# EAGLE design CANBed_FD (EAGLE 6.4)
DESCRIPTION: microOBD 200 OBD-II Module; HW_REV: 1.4; PCB_REV: C; PCB_SPEC1: Layer Count: 4; PCB_SPEC2: Size: 1.3" x 0.59"; PCB_SPEC3: Finish Thickness: 0.049" - 0.052"; PCB_SPEC4: Copper Weight: 1oz; TITLE: STM1120

## Sheet 1 of 2
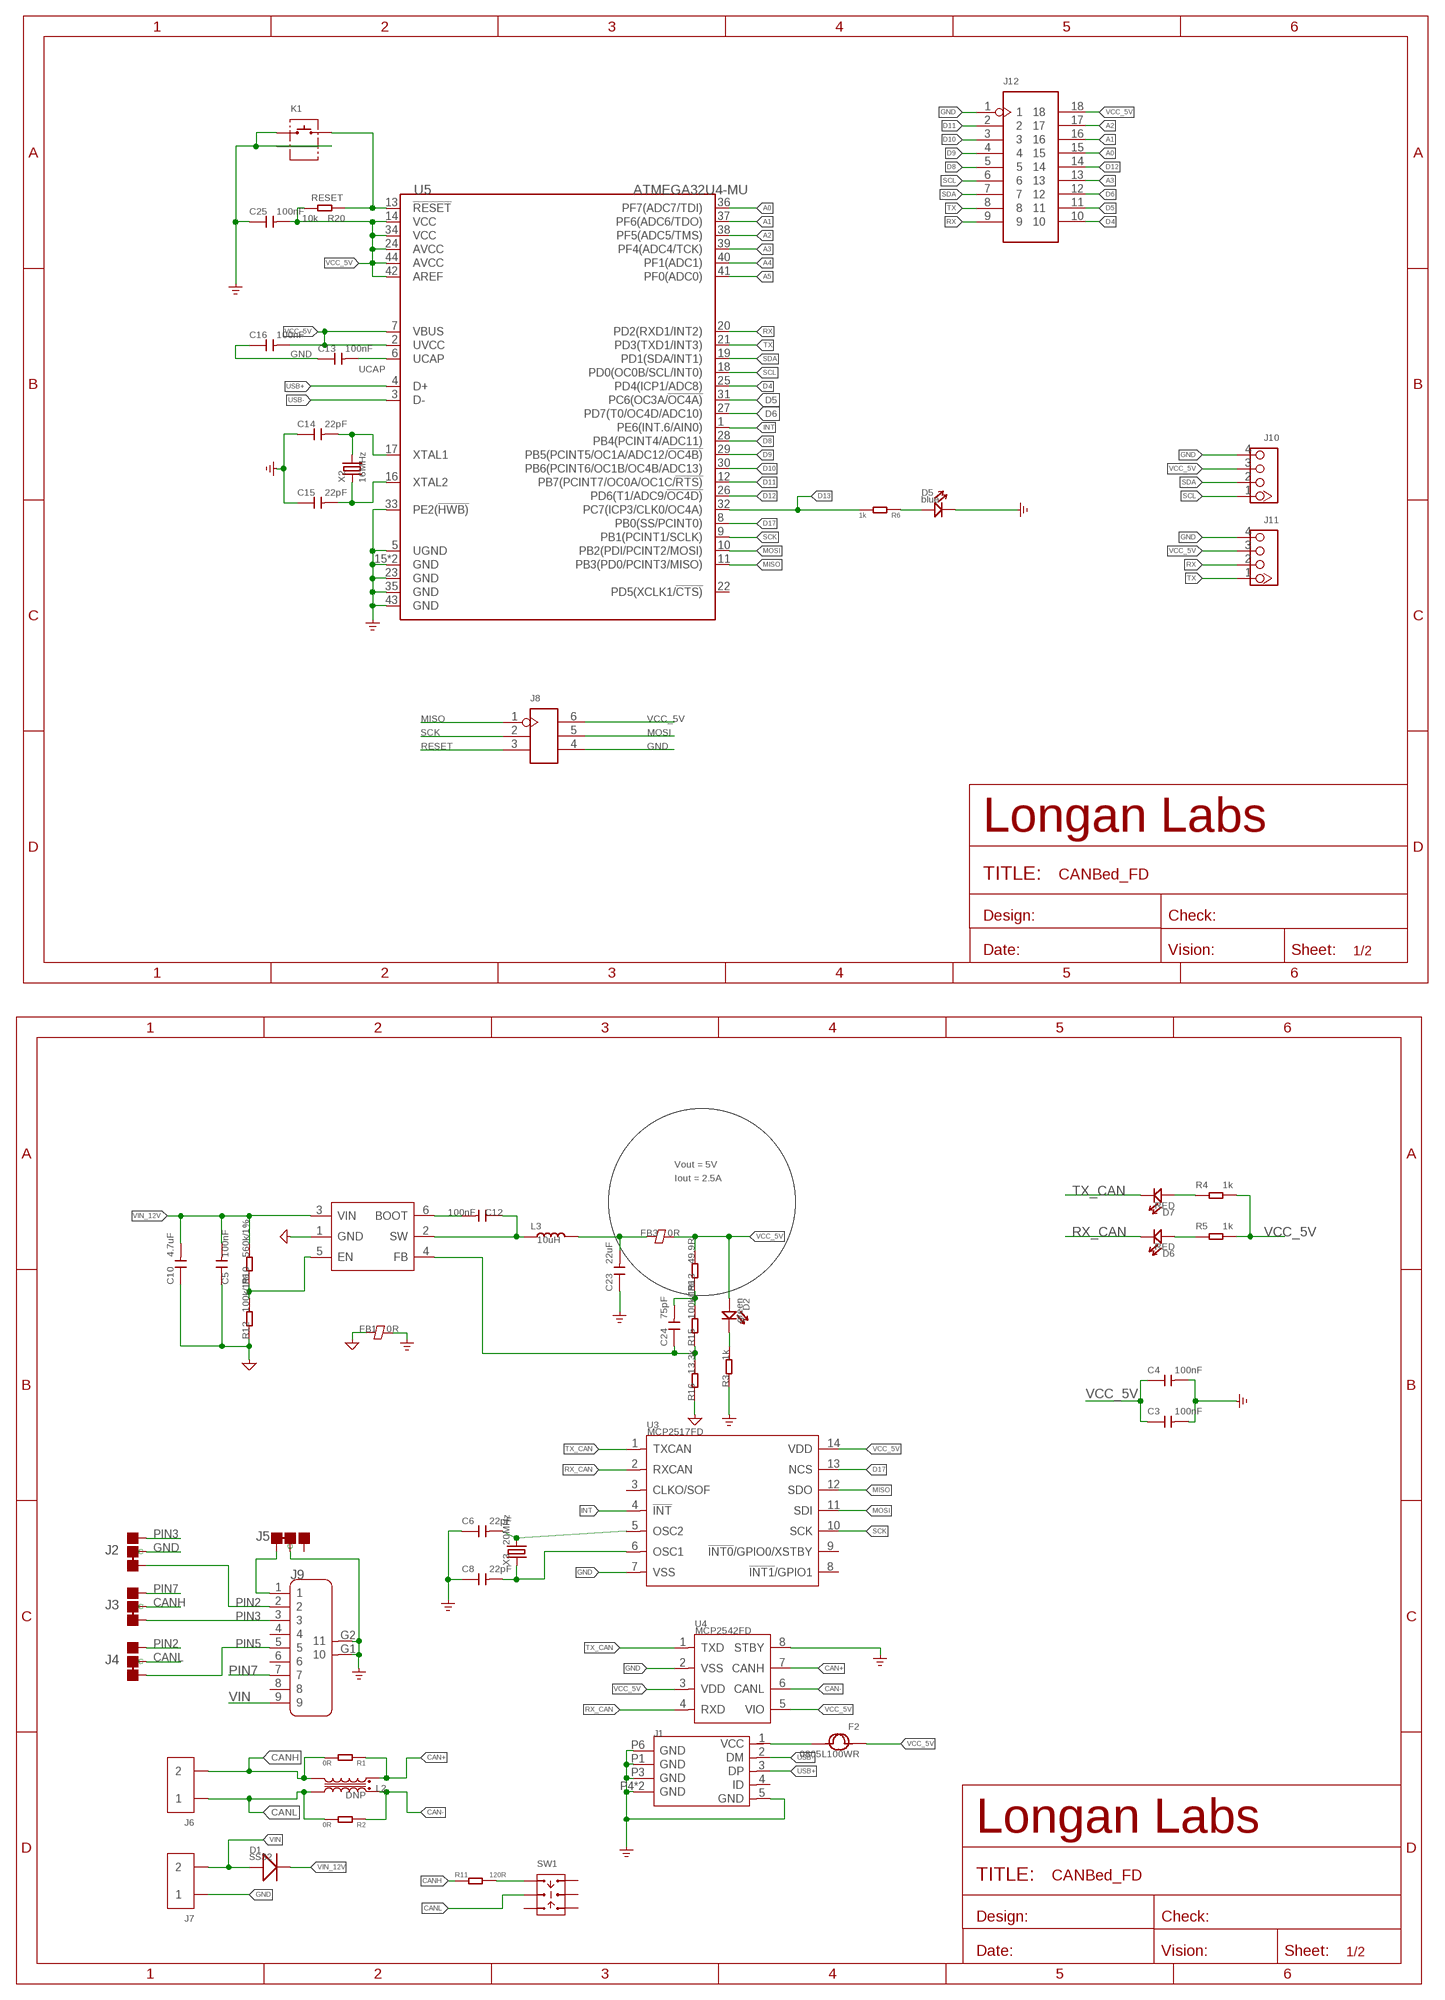
[diagram p0: schematic, sheet 1]

### Parts
C3  100nF  CAP-0603  [C0603]
C4  100nF  CAP-0603  [C0603]
C5  100nF  CAP-0603  [C0603]
C6  22pF  CAP-0603  [C0603]
C8  22pF  CAP-0603  [C0603]
C10  4.7uF  CAP-1206  [C1206]
C12  100nF  CAP-0603  [C0603]
C13  100nF  CAP-0603  [C0603]
C14  22pF  CAP-0603  [C0603]
C15  22pF  CAP-0603  [C0603]
C16  100nF  CAP-0603  [C0603]
C23  22uF  CAP-1206  [C1206]
C24  75pF  CAP-0603  [C0603]
C25  100nF  CAP-0603  [C0603]
D1  SS32  DIODE'SMA'  [DO-214AC]
D2  green  LED'0603'  [LED-0603]
D5  blue  LED'0603'  [LED-0603]
D6  RED  LED'0603'  [LED-0603]
D7  RED  LED'0603'  [LED-0603]
F2  0805L100WR  FUSE0805  [F0805]
FB1  0R  FERRITE-BEAD-0805  [F0805]
FB3  0R  FERRITE-BEAD-0805  [F0805]
J1  MICRO-USB5+4P-320010050  [MICRO-USB5+5P-SMD-0.65-7.2X5.06MM]
J2  JUMPER-3P-SHORT  [3P-SMD-SHORT]
J3  JUMPER-3P-SHORT  [3P-SMD-SHORT]
J4  JUMPER-3P-SHORT  [3P-SMD-SHORT]
J5  JUMPER-3P-SHORT  [3P-SMD-SHORT]
J6  SCREW-TERMINAL-2P'5.08'  [H2-5.0-10.5X8.0MM]
J7  SCREW-TERMINAL-2P'5.08'  [H2-5.0-10.5X8.0MM]
J8  HEADER-2X3P-2.54  [H2X3-2.54]
J9  DB9'MEAL'  [DB9-MEAL]
J10  320110033  GROVE-CONNECTOR-DIP-2.0  [HW4-2.0]
J11  320110033  GROVE-CONNECTOR-DIP-2.0  [HW4-2.0]
J12  HEADER-2X9P-2.54  [H2X9-2.54]
K1  BUTTON-2+2P  [SW2+2P-7.7X2.75X3.95MM]
L2  DNP  INDUCTOR-COMMON-MODE-SRF2012-900YA  [INT4-0.85-2X1.25X1.2MM]
L3  10uH  INDUCTOR-6.6X7.1  [INT2-SMD-6.6X7.1X3MM]
R1  0R  RES-0603  [R0603]
R2  0R  RES-0603  [R0603]
R3  1k  RES-0603  [R0603]
R4  1k  RES-0603  [R0603]
R5  1k  RES-0603  [R0603]
R6  1k  RES-0603  [R0603]
R10  560k/1%  RES-0603  [R0603]
R11  120R  RES-0603  [R0603]
R12  100k/1%  RES-0603  [R0603]
R13  49.9R  RES-0603  [R0603]
R15  100k/1%  RES-0603  [R0603]
R16  13.3k  RES-0603  [R0603]
R20  10k  RES-0603  [R0603]
SW1  SWITCH-2CH-6P-311010004  [SW6-2.54-9.0X3.5X3.2+2.0MM]
U1  PMIC-TPS54302  [SOT-23-6]
U3  MCP2517FD  CONTROLLER-MCP2517FD  [SOIC14-1.27-8.6X3.9MM]
U4  MCP2542FD  TRANSCEIVER-MCP2542  [SOIC8-1.27-5X4MM]
U5  ATMEGA32U4-MU  [QFN44]
X2  16MHz  CRYSTAL-2P'HC49US'  [HC49US]
X3  20MHz  CRYSTAL-2P'HC49US'  [HC49US]

### Nets
A0: J12.15 U5.36(PF7(ADC7/TDI))
A1: J12.16 U5.37(PF6(ADC6/TDO))
A2: J12.17 U5.38(PF5(ADC5/TMS))
A3: J12.13 U5.39(PF4(ADC4/TCK))
A4: U5.40(PF1(ADC1))
A5: U5.41(PF0(ADC0))
AGND: C5.1 C10.1 FB1.1 R12.1 R16.1 U1.1(GND) ; supply symbol labelled GND_SIGNAL
CAN+: L2.4 R1.1 U4.7(CANH)
CAN-: L2.1 R2.1 U4.6(CANL)
CANH: J3.MM(C) J6.2 L2.3 R1.2 R11.1
CANL: J4.MM(C) J6.1 L2.2 R2.2 SW1.COM1
D4: J12.10 U5.25(PD4(ICP1/ADC8))
D5: J12.11 U5.31(PC6(OC3A/!OC4A))
D6: J12.12 U5.27(PD7(T0/OC4D/ADC10))
D8: J12.5 U5.28(PB4(PCINT4/ADC11))
D9: J12.4 U5.29(PB5(PCINT5/OC1A/ADC12/!OC4B))
D10: J12.3 U5.30(PB6(PCINT6/OC1B/OC4B/ADC13))
D11: J12.2 U5.12(PB7(PCINT7/OC0A/OC1C/!RTS))
D12: J12.14 U5.26(PD6(T1/ADC9/!OC4D))
D13: R6.2 U5.32(PC7(ICP3/CLK0/OC4A))
D17: U3.13(NCS) U5.8(PB0(SS/PCINT0))
EXT_PWR: F2.2 J1.1(VCC)
GND: C3.2 C4.2 C6.1 C8.1 C13.1 C14.1 C15.1 C16.1 C23.1 C25.1 D5.- FB1.2 J1.5(GND) J1.P1(GND) J1.P3(GND) J1.P4(GND) J1.P5(GND) J1.P6(GND) J2.MM(C) J5.MM(C) J7.1 J8.4 J9.G1 J9.G2 J10.4 J11.4 J12.1 K1.1 K1.S1 K1.S2 R3.1 U3.7(VSS) U4.2(VSS) U4.8(STBY) U5.5(UGND) U5.15(GND) U5.23(GND) U5.33(PE2(!HWB)) U5.35(GND) U5.43(GND) U5.TAB(GND) ; supply symbol labelled GND_POWER
INT: U3.4(!INT) U5.1(PE6(INT.6/AIN0))
MISO: J8.1 U3.12(SDO) U5.11(PB3(PD0/PCINT3/MISO))
MOSI: J8.5 U3.11(SDI) U5.10(PB2(PDI/PCINT2/MOSI))
N$1: D2.- R3.2
N$2: D7.+ R4.1
N$4: R10.1 R12.2 U1.5(EN)
N$6: C14.2 U5.17(XTAL1) X2.2
N$8: D5.+ R6.1
N$10: C6.2 U3.5(OSC2) X3.2
N$11: C12.1 L3.1 U1.2(SW)
N$12: C15.2 U5.16(XTAL2) X2.1
N$13: J5.11(L) J9.1
N$14: C12.2 U1.6(BOOT)
N$15: D6.+ R5.1
N$16: R11.2 SW1.CH1A
N$18: C8.2 U3.6(OSC1) X3.1
N$19: C23.2 FB3.1 L3.2
N$23: C24.2 R13.1 R15.2
N$26: C24.1 R15.1 R16.2 U1.4(FB)
PIN2: J2.11(L) J4.00(R) J9.2
PIN3: J2.00(R) J3.11(L) J9.3
PIN5: J4.11(L) J9.5
PIN7: J3.00(R) J9.7
RESET: J8.3 K1.2 R20.1 U5.13(!RESET)
RX: J11.2 J12.9 U5.20(PD2(RXD1/INT2))
RX_CAN: D6.- U3.2(RXCAN) U4.4(RXD)
SCK: J8.2 U3.10(SCK) U5.9(PB1(PCINT1/SCLK))
SCL: J10.1 J12.6 U5.18(PD0(OC0B/SCL/INT0))
SDA: J10.2 J12.7 U5.19(PD1(SDA/INT1))
TX: J11.1 J12.8 U5.21(PD3(TXD1/INT3))
TX_CAN: D7.- U3.1(TXCAN) U4.1(TXD)
UCAP: C13.2 U5.6(UCAP)
USB+: J1.3(DP) U5.4(D+)
USB-: J1.2(DM) U5.3(D-)
VCC_5V: C3.1 C4.1 C16.2 C25.2 D2.+ F2.1 FB3.2 J8.6 J10.3 J11.3 J12.18 R4.2 R5.2 R13.2 R20.2 U3.14(VDD) U4.3(VDD) U4.5(VIO) U5.2(UVCC) U5.7(VBUS) U5.14(VCC) U5.24(AVCC) U5.34(VCC) U5.42(AREF) U5.44(AVCC)
VIN: D1.1(+) J7.2 J9.9
VIN_12V: C5.2 C10.2 D1.2(-) R10.2 U1.3(VIN)
Unconnected: J1.4(ID) J5.00(R) J9.4 J9.6 J9.8 SW1.CH1B SW1.CH2A SW1.CH2B SW1.COM2 U3.3(CLKO/SOF) U3.8(!INT1!/GPIO1) U3.9(!INT0!/GPIO0/XSTBY) U5.22(PD5(XCLK1/!CTS))

### Notes on the sheet
- Vout = 5V
- Iout = 2.5A

## Sheet 2 of 2

## Library data of the parts
C3-C6 C8 C10 C12-C16 C23-C25 = Discrete-new:CAP: Ceramic Capacitors
D1 = Discrete-new:DIODE*
D2 D5-D7 = Discrete-new:LED
F2 = Discrete-small:FUSE
FB1 FB3 = Discrete-new:FERRITE-BEAD
J1 = Connector-new:MICRO-USB5+4P: 320010137:MICRO USB B型DIP 沉板0.7无卷边 -ST-USB-01H2 320010000:MICRO USB 5F CCHT 6.45(0.8X0.9) -ST-USB-001G 320010050:USB-MC-001-05 320010025:MICRO USB 5S AB TYPE DIP7.2
J2-J5 = Discrete-new:JUMPER-3P-SHORT
J6 J7 = Connector-new:SCREW-TERMINAL-2P: 2P-3.5:320110028;2P-5.0:320110031
J8 = Connector-new:HEADER-2X3P
J9 = Connector:DB9
J10 J11 = Connector-new:GROVE-CONNECTOR-DIP: 4P-2.0:320110033;4P-2.0-90D:320110034
J12 = Connector-new:HEADER-2X9P
K1 = Connector-new:BUTTON-2+2P
L2 = Discrete-new:INDUCTOR-COMMON-MODE
L3 = Discrete-new:INDUCTOR
R1-R6 R10-R13 R15 R16 R20 = Discrete-new:RES
SW1 = Switch:SWITCH-2CH-6P
U1 = IC-new:PMIC-TPS54302
U3 = untitled:CONTROLLER-MCP2517FD
U4 = untitled:TRANSCEIVER-MCP2542
U5 = IC:ATMEGA32U4: 8-bit Microcontroller With 16/32K Bytes of ISP Flash and USB controller
X2 X3 = Discrete-new:CRYSTAL-2P

## Net classes
3 usbvcc: width 0.152 mm, drill 0.152 mm, clearance 0.152 mm

## Board
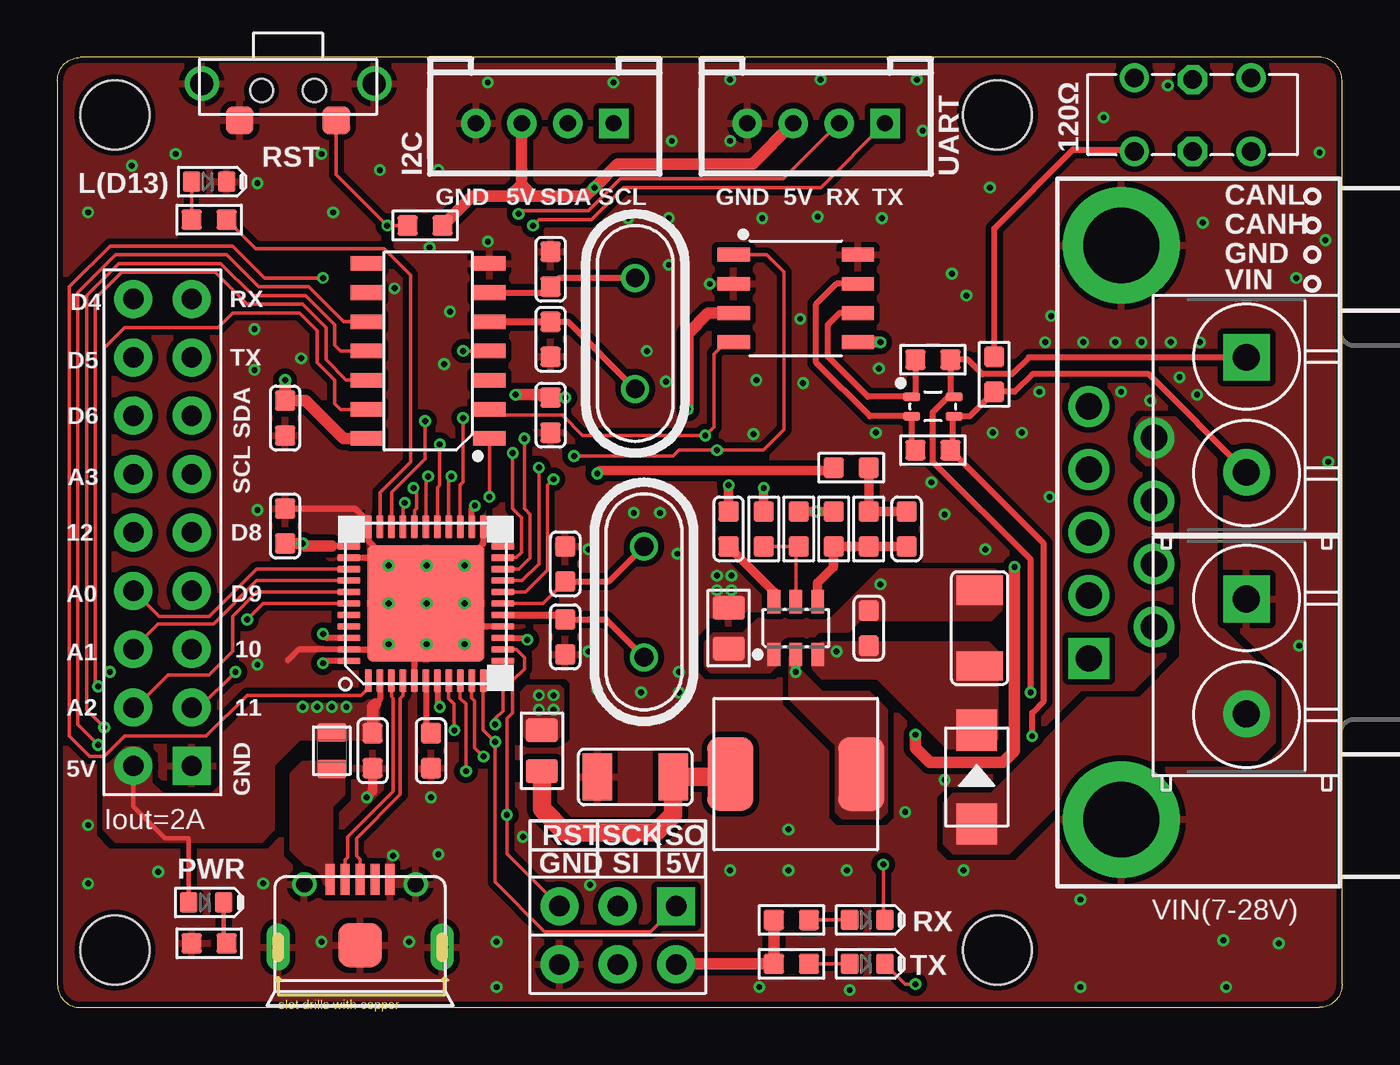
[diagram p1: board, top side]
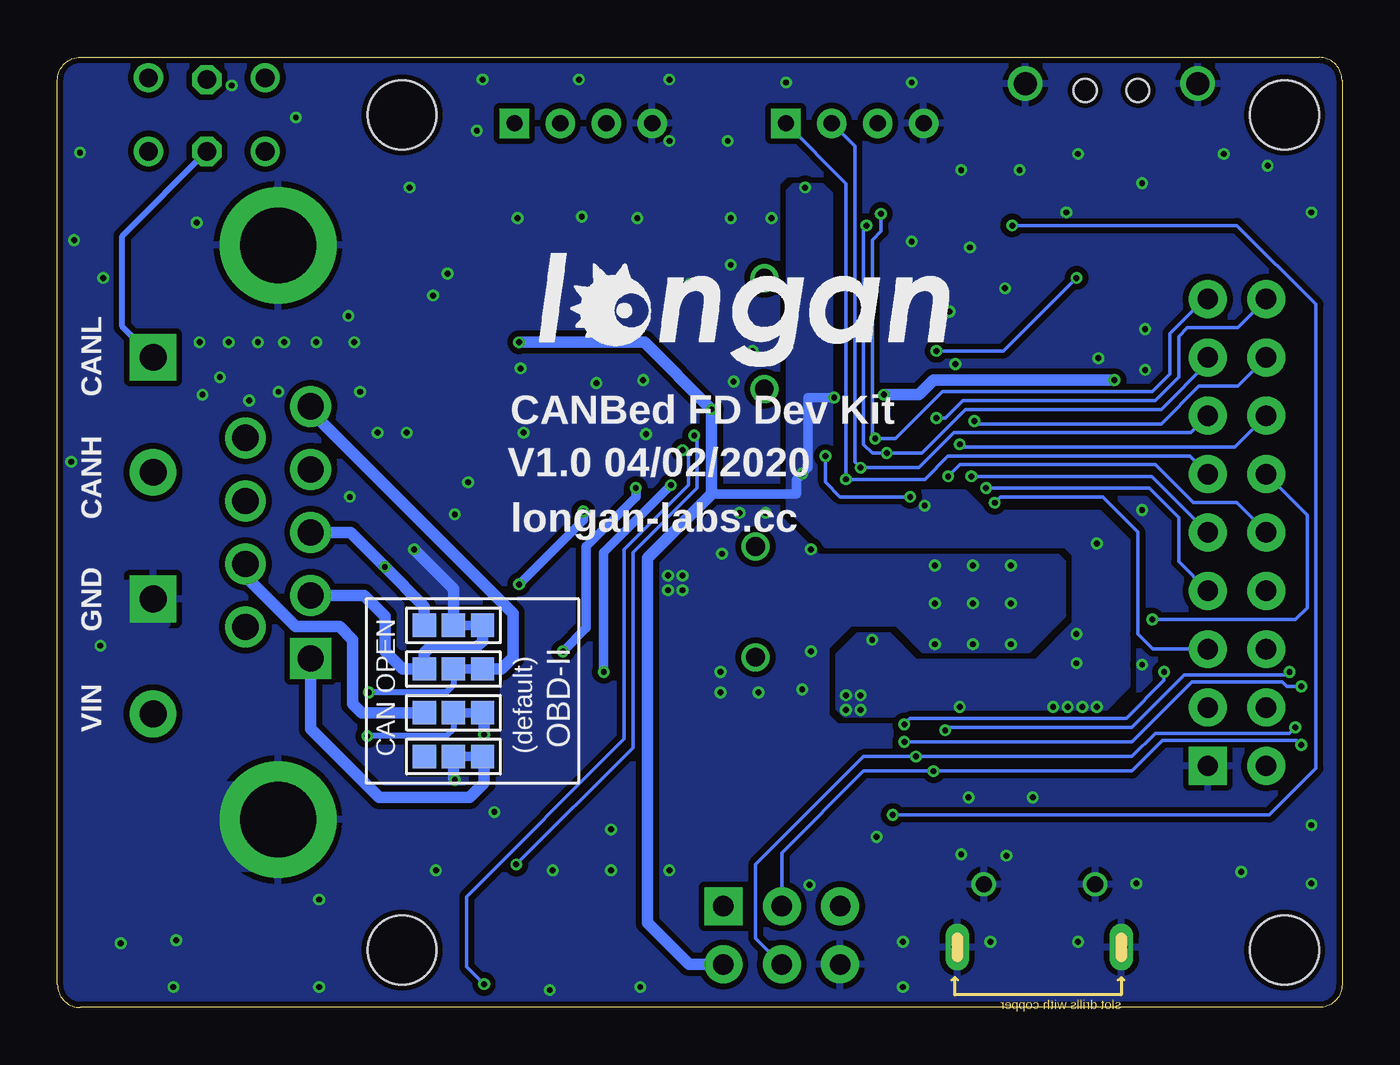
[diagram p2: board, bottom side, seen from below]

Size 55.91 x 41.35 mm. Coordinates in mm from the lower left corner, seen from the top.
Outline: 1,0 54.91,0 arc90 55.91,1 55.91,40.35 arc84 55.01,41.35 1,41.35 arc90 0,40.35 0,1 arc90 1,0
Copper layers (1*16): Top 0.035mm / dielectric 1.5mm / Bottom 0.035mm
Design rules "SeeedStudio_2layer_DRU_no_angle_20140221 *": minimum track width 1mil, minimum drill 10mil, track to track 6mil, track to pad 6mil, pad to pad 6mil, via to via 6mil, smd to smd 0mil, copper to edge 10mil, drill to drill 10mil, minimum pad ring 4mil, minimum via ring 4mil, stop-mask expansion 2mil, vias tented up to drill 25mil, thermal gap 10mil
Holes 3 mm at 2.5,38.85 2.5,2.5 40.91,38.85 40.91,2.5

### Footprints (pad centres in the part's own frame; a part is rotated, then mirrored left to right if it is on the bottom)
C0603 = smd 0.889 x 0.889: 1 -0.762,0; 2 0.762,0
C1206 = smd 1.27 x 2.032: 1 -1.651,0; 2 1.651,0
DO-214AC = smd 1.8 x 1.77: 1 -2.042,0; 2 2.042,0
LED-0603 = smd 0.762 x 0.889: + 0.762,0; - -0.762,0
F0805 = smd 0.819 x 1.27: 1 -0.79,0; 2 0.79,0
F0805' = smd 1.016 x 1.397: 1 -0.889,0; 2 0.889,0
MICRO-USB5+5P-SMD-0.65-7.2X5.06MM = smd 0.4 x 1.35: 1 -1.3,2.875; 2 -0.65,2.875; 3 0,2.875; 4 0.65,2.875; 5 1.3,2.875 | smd 1.9 x 1.9: P1 0,0 | drill 0.508 pad 1.016 long: P3 -3.575,-0.08; P4 3.575,-0.08 | drill 0.7: P5 -2.425,2.65; P6 2.425,2.65
3P-SMD-SHORT = smd 1.016 x 1.016: 00 -1.27,0; 11 1.27,0; MM 0,0
H2-5.0-10.5X8.0MM = drill 1.168 pad 2.032 square: 1 0,2.5 | drill 1.168 pad 2.032: 2 0,-2.5
H2X3-2.54 = drill 0.889 pad 1.651 square: 1 -1.27,2.54 | drill 0.889 pad 1.651: 2 -1.27,0; 3 -1.27,-2.54; 4 1.27,-2.54; 5 1.27,0; 6 1.27,2.54
DB9-MEAL = drill 1.143 pad 1.778 square: 1 -5.486,1.422 | drill 1.143 pad 1.778: 2 -2.743,1.422; 3 0,1.422; 4 2.743,1.422; 5 5.486,1.422; 6 -4.115,-1.422; 7 -1.372,-1.422; 8 1.372,-1.422; 9 4.115,-1.422 | drill 3.302 pad 5.08: G1 12.497,0; G2 -12.497,0
HW4-2.0 = drill 0.7 pad 1.27 square: 1 -3,0 | drill 0.7 pad 1.27: 2 -1,0; 3 1,0; 4 3,0
H2X9-2.54 = drill 0.889 pad 1.651 square: 1 -1.27,10.16 | drill 0.889 pad 1.651: 2 -1.27,7.62; 3 -1.27,5.08; 4 -1.27,2.54; 5 -1.27,0; 6 -1.27,-2.54; 7 -1.27,-5.08; 8 -1.27,-7.62; 9 -1.27,-10.16; 10 1.27,-10.16; 11 1.27,-7.62; 12 1.27,-5.08; 13 1.27,-2.54; 14 1.27,0; 15 1.27,2.54; 16 1.27,5.08; 17 1.27,7.62; 18 1.27,10.16
SW2+2P-7.7X2.75X3.95MM = smd 1.2 x 1.2: 1 -2.1,0; 2 2.1,0 | drill 1 pad 1.5: S1 -3.75,1.6; S2 3.75,1.6 | hole 1: -1.15,1.3; 1.15,1.3
INT4-0.85-2X1.25X1.2MM = smd 0.4 x 0.75: 1 -0.425,-0.925; 2 -0.425,0.925; 3 0.425,0.925; 4 0.425,-0.925
INT2-SMD-6.6X7.1X3MM = smd 2 x 3.2: 1 -2.85,0; 2 2.85,0
R0603 = smd 0.889 x 0.889: 1 -0.762,0; 2 0.762,0
SW6-2.54-9.0X3.5X3.2+2.0MM = drill 0.813 pad 1.27: CH1A -2.54,-1.6; CH1B 2.54,-1.6; CH2A -2.54,1.6; CH2B 2.54,1.6 | drill 0.813 pad 1.27 octagon: COM1 0,-1.6; COM2 0,1.524
SOT-23-6 = smd 0.55 x 1.016: 1 -0.95,-1.143; 2 0,-1.143; 3 0.95,-1.143; 4 0.95,1.143; 5 0,1.143; 6 -0.95,1.143
SOIC14-1.27-8.6X3.9MM = smd 0.635 x 1.397: 1 -3.81,-2.667; 2 -2.54,-2.667; 3 -1.27,-2.667; 4 0,-2.667; 5 1.27,-2.667; 6 2.54,-2.667; 7 3.81,-2.667; 8 3.81,2.667; 9 2.54,2.667; 10 1.27,2.667; 11 0,2.667; 12 -1.27,2.667; 13 -2.54,2.667; 14 -3.81,2.667
SOIC8-1.27-5X4MM = smd 0.6 x 1.4: 1 -1.905,-2.7; 2 -0.635,-2.7; 3 0.635,-2.7; 4 1.905,-2.7; 5 1.905,2.7; 6 0.635,2.7; 7 -0.635,2.7; 8 -1.905,2.7
QFN44 = smd 1 x 0.3: 1 -3.35,2.5; 2 -3.35,2; 3 -3.35,1.5; 4 -3.35,1; 5 -3.35,0.5; 6 -3.35,0; 7 -3.35,-0.5; 8 -3.35,-1; 9 -3.35,-1.5; 10 -3.35,-2; 11 -3.35,-2.5; 23 3.35,-2.5; 24 3.35,-2; 25 3.35,-1.5; 26 3.35,-1; 27 3.35,-0.5; 28 3.35,0; 29 3.35,0.5; 30 3.35,1; 31 3.35,1.5; 32 3.35,2; 33 3.35,2.5 | smd 0.3 x 1: 12 -2.5,-3.35; 13 -2,-3.35; 14 -1.5,-3.35; 15 -1,-3.35; 16 -0.5,-3.35; 17 0,-3.35; 18 0.5,-3.35; 19 1,-3.35; 20 1.5,-3.35; 21 2,-3.35; 22 2.5,-3.35; 34 2.5,3.35; 35 2,3.35; 36 1.5,3.35; 37 1,3.35; 38 0.5,3.35; 39 0,3.35; 40 -0.5,3.35; 41 -1,3.35; 42 -1.5,3.35; 43 -2,3.35; 44 -2.5,3.35 | smd 5.08 x 5.08: TAB 0,0
HC49US = drill 0.813: 1 -2.413,0; 2 2.413,0

### Placement (x,y rotation side)
C3  21.46,25.78 270 top
C4  9.91,25.65 270 top
C5  35.31,16.51 270 top
C6  21.46,29.08 90 top
C8  21.46,32.13 270 top
C10  40.13,16.51 270 top
C12  29.21,20.83 270 top
C13  16.26,11.18 90 top
C14  22.1,19.3 270 top
C15  22.1,16.13 90 top
C16  13.72,11.18 90 top
C23  25.15,10.03 0 top
C24  36.96,20.83 90 top
C25  9.91,20.95 270 top
D1  40.01,10.03 90 top
D2  6.48,4.57 180 top
D5  6.6,35.94 180 top
D6  35.24,3.81 180 top
D7  35.24,1.91 180 top
F2  11.94,11.18 270 top
FB1  0R  [F0805']  29.21,16.51 90 top
FB3  0R  [F0805']  21.08,11.18 90 top
J1  13.17,2.71 0 top
J2  38.67,16.64 0 bottom
J3  38.67,12.83 0 bottom
J4  38.67,14.73 0 bottom
J5  38.67,10.92 0 bottom
J6  51.75,25.8 0 top
J7  51.75,15.28 0 top
J8  24.38,3.14 270 top
J9  46.31,20.68 90 top
J10  21.21,38.48 180 top
J11  33.02,38.48 180 top
J12  4.57,20.68 180 top
K1  10.03,38.61 0 top
L2  38.1,26.16 270 top
L3  32.13,10.16 180 top
R1  38.1,24.26 0 top
R2  38.1,28.19 0 top
R3  6.6,2.79 0 top
R4  31.94,1.91 180 top
R5  31.94,3.81 180 top
R6  6.6,34.29 0 top
R10  30.73,20.83 90 top
R11  40.77,27.56 90 top
R12  32.26,20.83 270 top
R13  34.54,23.5 180 top
R15  35.31,20.83 90 top
R16  33.78,20.83 270 top
R20  16,34.04 0 top
SW1  49.4,38.86 0 top
U1  32.13,16.51 0 top
U3  16.13,28.57 90 top
U4  32.13,30.86 270 top
U5  16.03,17.58 90 top
U$12  [LONGAN-SILK-SMALL]  36.58,26.42 0 bottom
X2  25.53,17.65 90 top
X3  25.15,29.34 270 top

### Tracks (layer width: path | path; a pad name or v marks a point on that pad's centre or on a via)
A0
  Top 0.152: U5.36 8.66,19.08 6.6,17.02 4.42,17.02 J12.15
A1
  Top 0.152: U5.37 8.67,18.58 6.79,16.7 4.38,16.7 3.3,15.62 J12.16
A2
  Top 0.152: U5.38 8.68,18.08 7.62,17.02 7.62,15.49 6.6,14.48 4.83,14.48 3.4,13.05 J12.17
A3  (via drill 0.25 pad 0.51)
  Top 0.152: U5.39 8.94,17.58 v8.26,16.89
  Bottom 0.152: v8.26,16.89 2.03,16.89 1.52,17.4 1.52,21.44 J12.13
AGND  (via drill 0.25 pad 0.51)
  Top 0.406: R16.1 v33.02,21.59 R12.1
  Bottom 0.406: v33.02,21.59 33.02,21.21 v35.81,18.41
  pour Top (isolate 0.254, no thermals): 40.77,19.05 35.81,19.05 33.66,16.89 30.48,16.89 29.84,16.26 28.55,16.26 28.19,15.9 28.19,14.86 28.45,14.61 30.99,14.61 31.37,14.99 31.37,15.88 31.62,16.13 32.89,16.13 33.02,16.26 33.15,16.38 34.42,16.38 34.92,16.89 40.64,16.89 41.15,17.4 41.15,18.67
CAN+
  Top 0.254: U4.7 33.91,31.5 33.02,30.61 33.02,28.07 35.35,25.74 L2.4 37.17,24.42 R1.1
CAN-
  Top 0.254: U4.6 34.04,30.23 33.53,29.72 33.53,28.32 35.26,26.59 L2.1 37.34,26.75 R2.1
CANH  (via drill 0.25 pad 0.51)
  Top 0.254: J6.2 47.5,27.56 42.42,27.56 41.66,26.8 R11.1 39.71,25.74 L2.3 38.95,25.74 38.95,24.34 R1.2 42.93,20.19 42.93,13.34 42.42,12.83 v42.42,11.81
  Bottom 0.254: J3.MM 38.67,12.13 38.99,11.81 v42.42,11.81
CANL  (via drill 0.25 pad 0.51)
  Top 0.254: v42.35,13.72 42.35,19.49 38.1,23.75 38.1,25.91 38.78,26.59 L2.2 38.86,26.75 R2.2 39.62,28.19 40.26,27.56 41.53,27.56 42.27,28.3 J6.1
  Bottom 0.254: J4.MM 38.67,14.03 38.99,13.72 v42.35,13.72 | J6.1 53.09,29.64 53.09,33.58 SW1.COM1
D4  (via drill 0.25 pad 0.51)
  Top 0.152: U5.25 17.53,22.74 17.65,22.86 v17.65,25.65
  Bottom 0.152: J12.10 4.55,29.59 6.73,29.59 7.11,29.21 7.11,27.43 8.13,26.42 16.51,26.42 17.27,25.65 v17.65,25.65
D5  (via drill 0.25 pad 0.51)
  Top 0.152: U5.31 14.53,22.41 16,23.88 v16,25.53
  Bottom 0.152: J12.11 4.55,27.05 6.22,27.05 7.87,25.4 15.88,25.4 v16,25.53
D6  (via drill 0.25 pad 0.51)
  Top 0.152: U5.27 16.53,22.63 16.64,22.73 v16.64,24.51
  Bottom 0.152: J12.12 4.67,24.38 16.51,24.38 v16.64,24.51
D8  (via drill 0.25 pad 0.51)
  Top 0.152: U5.28 16.03,23.02 v16.13,23.11
  Bottom 0.152: v16.13,23.11 8.28,23.11 J12.5
D9  (via drill 0.25 pad 0.51)
  Top 0.152: U5.29 15.53,21.63 15.62,21.72 15.62,22.48 v15.49,22.61
  Bottom 0.152: v15.49,22.61 8.38,22.61 7.11,21.34 7.11,19.41 J12.4
D10  (via drill 0.25 pad 0.51)
  Top 0.152: U5.30 15.03,21.89 v15.11,21.97
  Bottom 0.152: J12.3 8.23,15.6 8.89,16.26 8.89,20.7 10.41,22.23 14.86,22.23 v15.11,21.97
D11  (via drill 0.25 pad 0.51)
  Top 0.152: J12.2 6.2,13.05 v7.75,14.61 | U5.12 19.38,12.91 19.05,12.57 v19.05,12.32
  Bottom 0.152: v7.75,14.61 7.75,14.22 9.4,12.57 18.67,12.57 18.8,12.57 v19.05,12.32
D12  (via drill 0.25 pad 0.51)
  Top 0.152: U5.26 17.03,23 v17.14,23.11
  Bottom 0.152: J12.14 3.3,20.7 4.57,21.97 6.48,21.97 8.13,23.62 16.64,23.62 v17.14,23.11
D13
  Top 0.152: U5.32 14.03,22.41 15.37,23.75 15.37,31.88 14.22,33.02 8.64,33.02 R6.2
D17  (via drill 0.25 pad 0.51)
  Top 0.152: U5.8 17.03,13.45 17.27,13.21 v17.27,12.06 | v2.29,14.61 2.03,14.86 2.03,28.7 2.92,29.59 6.99,29.59 7.62,30.23 10.54,30.23 11.3,29.46 11.3,28.07 12.06,27.3 12.06,26.29 12.32,26.04 U3.13
  Bottom 0.152: v2.29,14.61 2.41,14.48 6.86,14.48 9.14,12.19 17.14,12.19 v17.27,12.06
EXT_PWR
  pour Top (isolate 0.254, no thermals): 11.81,5.21 10.79,6.22 10.16,6.86 10.16,10.16 10.67,10.67 12.19,10.67 12.45,10.41 12.45,9.27 11.94,8.76 11.94,5.33
GND  (via drill 0.25 pad 0.51)
  Top 0.254: v14.41,15.81 14.18,15.58 U5.43 10.5,15.58 10.03,15.11 | U5.5 15.53,15.28 v16.07,15.81 | U5.15 18.48,16.58 v17.72,15.81 | U5.23 18.53,20.18 17.72,19.37 v17.72,19.24 | C25.1 12.95,21.72 13.53,21.14 U5.33 13.53,20.31 13.97,19.88 13.97,19.58 | U5.35 13.97,19.58 | 13.97,19.58 14.08,19.58 v14.41,19.24
  Top 0.406: C16.1 13.72,9.4 v13.46,9.14
  Bottom 0.508: J5.MM 38.67,9.97 v38.61,9.91 | J2.MM 38.67,18.22 v40.39,19.94
  other vias: 16.26,9.14 25.65,28.57 29.34,18.16 28.7,18.16 28.7,18.8 29.34,18.8 25.4,13.72 27.05,13.72 27.05,14.61 23.5,13.84 23.11,15.49 23.11,19.94 14.61,6.6 16.07,17.59 17.72,17.59 14.41,17.59 16.07,19.24 8.7,21.65 8.57,27.75 8.57,29.53 12,34.61 26.48,27.24 26.61,32.32 38.93,31.94 37.66,38.16 26.99,19.75 26.23,21.53 25.08,21.53 11.49,37.15 8.7,35.88 5.14,37.15 3.24,36.64 1.33,34.61 1.33,7.94 1.33,5.4 4.38,5.91 8.95,5.4 11.49,2.86 15.3,2.86 19.11,2.86 16.57,6.67 20.26,7.43 19.11,0.89 30.54,0.89 34.48,0.76 44.51,0.89 44.51,4.7 39.43,5.97 36.89,8.51 34.35,5.97 31.81,5.97 29.27,5.97 31.81,7.75 23.18,5.33 50.74,2.92 50.86,0.89 53.15,2.79 54.04,15.75 55.31,23.75 53.91,31.75 55.18,33.4 54.93,37.21 48.32,40.13 49.85,34.16 40.58,35.69 45.53,38.73 35.62,25.02 29.27,37.72 26.73,37.72 16.57,36.45 14.03,36.45 43.24,30.1 39.56,30.99 40.7,25.02 41.97,25.02 49.72,28.96 8.7,14.92 38.61,21.46 43.18,22.23 29.27,40.39 37.4,40.39 33.21,40.39 24.19,40.26 18.73,40.26 26.61,34.35 24.83,34.35 18.73,33.34 16.19,33.08 30.67,34.35 35.88,34.35 38.04,22.86 32.45,27.18 30.42,27.3 28.38,31.5 33.08,34.42 32.32,29.97 35.75,27.81 17.08,30.29 16.83,28 14.67,31.31 10.6,28.26 30.29,24.96 48.45,28.96 47.18,28.96 46.04,28.96 44.64,28.96 42.99,28.96 42.74,26.8 46.29,26.8 47.56,26.42 48.83,27.43 49.59,26.67
  pour Top (isolate 0.254, no thermals): 28.07,17.02 29.72,17.02 29.97,17.27 29.97,18.67 29.59,19.05 27.18,19.05 26.29,18.16 26.29,14.61 26.04,14.35 23.11,14.35 22.61,13.84 22.61,12.45 22.86,12.19 27.43,12.19 27.69,12.45 27.69,16.64
  pour Bottom (isolate 0.254, no thermals): 52.07,18.54 54.48,18.54 54.99,18.03 54.99,7.62 53.34,5.97 45.21,5.97 44.58,6.6 44.58,9.02 45.34,9.78 51.94,9.78 53.09,10.92 53.09,14.61 51.05,16.64 51.05,18.29 51.31,18.54
  pour Top (isolate 0.254, rank 6): -0.64,41.91 56.52,41.91 56.52,-0.64 -0.64,-0.64
  pour Bottom (isolate 0.254, rank 6): -0.64,41.91 56.52,41.91 56.52,-0.64 -0.64,-0.64
INT  (via drill 0.25 pad 0.51)
  Top 0.152: U5.1 13.53,13.91 13.21,13.59 8.26,13.59 6.48,11.81 2.92,11.81 2.03,10.92 1.4,10.92 0.51,11.81 0.51,31.37 2.29,33.15 7.62,33.15 9.02,31.75 11.18,31.75 11.3,31.75 v11.56,31.75 | U3.4 v17.65,28.57
  Bottom 0.152: v17.65,28.57 14.73,28.57 v11.56,31.75
MISO  (via drill 0.25 pad 0.51)
  Top 0.152: v1.78,13.97 1.65,14.1 1.65,30.86 2.79,32 6.86,32 8.26,30.61 10.67,30.61 11.68,29.59 11.68,28.19 12.57,27.3 U3.12 | U5.11 18.53,12.07 v19.05,11.56 19.05,5.46 21.21,3.3 25.81,3.3 J8.1
  Bottom 0.152: v1.78,13.97 2.41,13.97 2.6,14.16 6.54,14.16 9.14,11.56 v19.05,11.56
MOSI  (via drill 0.25 pad 0.51)
  Top 0.152: v2.03,12.19 1.27,12.95 1.27,30.99 2.67,32.38 7.11,32.38 8.51,30.99 10.79,30.99 12.06,29.72 12.06,28.83 12.32,28.57 U3.11 | U5.10 18.03,13.46 18.16,13.34 18.16,11.3 v18.54,10.92
  Bottom 0.152: v2.03,12.19 2.29,11.94 8.13,11.94 9.14,10.92 v18.54,10.92 20.83,10.92 25.53,6.22 25.53,3.02 J8.5
N$1
  Top 0.203: D2.- 7.24,2.92 R3.2
N$2
  Top 0.152: D7.+ R4.1
N$4
  Top 0.152: U1.5 32.13,19.94 R12.2 R10.1
N$6
  Top 0.152: U5.17 21.13,17.58 C14.2
  Top 0.254: C14.2 24,18.54 X2.2
N$8
  Top 0.152: R6.1 D5.+
N$10
  Top 0.254: C6.2 22.23,29.84 X3.2
  Top 0.305: U3.5 C6.2
N$11  (via drill 0.25 pad 0.51)
  Top 0.406: U1.2 v32.13,14.61 | C12.1 v29.21,22.73
  Bottom 0.406: v32.13,14.61 32.13,19.81 v29.21,22.73
  pour Top (isolate 0.254, no thermals): 32.13,15.37 32.26,15.24 32.26,14.73 33.27,13.72 35.31,13.72 36.07,12.95 36.07,8.51 35.81,8.26 34.16,8.26 33.91,8.51 33.91,11.43 31.88,13.46 31.88,15.24 32,15.37
N$12
  Top 0.254: C15.2 23.88,16.89 X2.1
  Top 0.305: U5.16 21.91,17.08 C15.2
N$13
  Bottom 0.508: J5.11 37.34,10.86 37.34,9.78 37.97,9.14 41.91,9.14 44.88,12.12 J9.1
N$14
  Top 0.406: U1.6 31.18,18.09 C12.2
N$15
  Top 0.152: D6.+ R5.1
N$16
  Top 0.254: R11.2 40.77,33.91 44.2,37.34 46.79,37.34 SW1.CH1A
N$18
  Top 0.254: U3.6 21.21,31.11 C8.2 21.84,31.75 X3.1
N$19
  Top 0.813: L3.2 29.15,10.03 C23.2 26.8,8.38 26.04,7.62 22.1,7.62 21.08,8.64 FB3.1
N$23
  Top 0.406: C24.2 R15.2 R13.1
N$26
  Top 0.406: U1.4 33.08,18.48 33.78,19.18 R16.2 35.18,20.07 35.31,19.94 R15.1 C24.1
PIN2
  Bottom 0.508: J2.11 37.4,15.94 37.66,15.68 39.69,15.68 39.94,15.43 J4.00 40.89,14.73 41.66,15.49 41.66,17.02 42.57,17.93 J9.2
PIN3  (via drill 0.25 pad 0.51)
  Top 0.508: v41.66,19.18 41.66,11.18 41.15,10.67 37.97,10.67 37.34,11.3 v37.34,11.87
  Bottom 0.508: J2.00 39.94,17.46 v41.66,19.18 43.15,20.68 J9.3 | v37.34,11.87 37.34,12.76 J3.11
PIN5
  Bottom 0.508: J4.11 36.58,14.73 36.07,15.24 36.07,17.14 42.1,23.18 42.16,23.24 44.88,25.96 J9.5
PIN7
  Bottom 0.508: J9.7 47.73,18.77 45.53,16.57 43.62,16.57 43.05,16 43.05,13.21 42.67,12.83 J3.00
RESET  (via drill 0.25 pad 0.51)
  Top 0.152: U5.13 19.98,15.58 20.32,15.24 20.32,14.73 19.81,14.22 19.81,12.83 19.56,12.57 v19.56,8.38 19.56,6.7 J8.3 | R20.1 v14.35,34.04 12.13,36.25 K1.2
  Bottom 0.152: v14.35,34.04 4.57,34.04 1.14,30.61 1.14,10.41 3.17,8.38 v19.56,8.38
RX  (via drill 0.25 pad 0.51)
  Top 0.152: U5.20 20.09,19.08 20.57,19.56 20.57,21.46 20.32,21.72 v20.32,24.77 | v20.07,34.54 20.19,34.67 23.11,34.67 24.51,36.07 31.61,36.07 J11.2
  Bottom 0.152: J12.9 6,30.84 7.49,29.34 7.49,27.56 8.26,26.8 17.4,26.8 19.43,24.77 v20.32,24.77 20.45,24.89 20.45,33.4 20.07,33.78 v20.07,34.54
RX_CAN  (via drill 0.25 pad 0.51)
  Top 0.152: v35.94,6.22 35.94,3.87 D6.- | U3.2 19.05,25.78 21.97,25.78 22.86,24.89 v28.19,24.89 28.57,25.27 28.57,28.45 29.08,28.96 U4.4
  Bottom 0.152: v35.94,6.22 30.86,11.3 30.86,19.81 28.07,22.61 28.07,24.77 v28.19,24.89
SCK  (via drill 0.25 pad 0.51)
  Top 0.152: v1.78,11.43 0.89,12.32 0.89,31.11 2.54,32.77 7.37,32.77 8.76,31.37 10.92,31.37 12.45,29.84 U3.10 | U5.9 17.53,13.46 17.78,13.21 v17.78,10.29
  Bottom 0.152: v1.78,11.43 1.97,11.62 7.81,11.62 9.14,10.29 v17.78,10.29 20.83,10.29 24.38,6.73 J8.2
SCL  (via drill 0.25 pad 0.51)
  Top 0.152: U5.18 20.36,18.08 21.34,19.05 21.34,22.73 v21.59,22.99
  Bottom 0.152: J12.6 6.63,24 17.14,24 18.16,22.99 v21.59,22.99 21.59,35.86 J10.1
SDA  (via drill 0.25 pad 0.51)
  Top 0.152: U5.19 20.23,18.58 20.95,19.3 v20.95,23.5
  Bottom 0.152: J12.7 6.58,25.02 16.89,25.02 18.41,23.5 v20.95,23.5 21.21,23.75 21.21,37.48 J10.2
TX  (via drill 0.25 pad 0.51)
  Top 0.152: U5.21 19.96,19.58 20.19,19.81 20.19,21.34 19.81,21.72 v19.81,24.13 | v20.7,34.04 20.95,34.29 23.24,34.29 24.64,35.69 33.23,35.69 J11.1
  Bottom 0.152: J12.8 5.84,28.07 7.87,26.04 16.38,26.04 18.29,24.13 v19.81,24.13 20.45,24.13 20.83,24.51 20.83,33.91 v20.7,34.04
TX_CAN  (via drill 0.25 pad 0.51)
  Top 0.152: v37.34,1.02 36.89,1.02 D7.- | U3.1 v18.8,22.23 | v22.48,24 26.8,24 27.05,24.26 v28.7,24.26 30.73,24.26 31.62,25.15 31.62,32 30.86,32.77 U4.1
  Bottom 0.152: v37.34,1.02 38.1,1.78 38.1,4.83 31.24,11.68 31.24,19.94 28.45,22.73 28.45,24 v28.7,24.26 | v18.8,22.23 21.84,22.23 22.48,22.86 v22.48,24
UCAP
  Top 0.254: U5.6 16.03,12.16 C13.2
USB+
  Top 0.152: U5.4 15.03,13.57 14.92,13.46 14.92,9.27 13.02,7.37 13.02,6.6 13.17,6.45 J1.3
USB-
  Top 0.152: U5.3 14.53,13.53 14.61,13.46 14.61,9.4 12.64,7.43 12.64,6.54 12.52,6.42 J1.2
VCC_5V  (via drill 0.25 pad 0.51)
  Top 0.203: D2.+ 5.71,7.37 4.7,7.37 3.3,8.76 3.3,10.41 | 3.3,10.41 3.17,10.54 3.17,10.67 3.3,10.54 3.3,10.41
  Top 0.254: U5.2 14.03,13.4 13.84,13.21 | U5.7 16.53,13.19 v16.64,13.08 | U5.14 20.37,16.08 v20.45,16 | U5.24 18.03,21.72 v18.16,21.84 | U5.34 11.93,20.08 | U5.42 11.73,16.08 v11.56,16.26 | U5.44 11.65,15.08 v11.56,14.99
  Top 0.406: v23.5,23.24 23.62,23.37 33.66,23.37 R13.2 | v22.1,26.54 C3.1 21.08,26.54 20.95,26.67
  Top 0.508: 13.84,13.21 13.72,13.08 C16.2 | 11.93,20.08 10.78,20.08 v10.67,20.19 C25.2 | J10.3 20.21,35.32 20.19,35.31 | 20.7,35.31 20.19,35.31 | 20.19,35.31 19.68,35.31 | 19.68,35.31 18.03,35.31 R20.2 | 19.68,35.31 20.19,35.81 20.7,35.31 | v9.91,27.3 C4.1 10.79,26.42 12.45,24.77 U3.14 | R5.2 R4.2 26.96,1.91 J8.6 | v27.43,26.04 27.43,29.34 28.32,30.23 U4.3 | U4.5 v35.81,28.96 | v19.94,26.67 20.95,26.67 | J11.3 30.24,36.7 24.38,36.7 v23.37,35.69 22.99,35.31 20.7,35.31
  Bottom 0.406: v22.1,26.54 23.24,26.54 23.24,23.5 v23.5,23.24 23.75,22.99 23.75,22.35 27.43,22.35
  Bottom 0.508: J8.6 28.41,1.87 30.23,3.68 30.23,19.56 27.43,22.35 v27.43,26.04 30.35,28.96 v35.81,28.96 | v19.94,26.67 18.41,26.67 17.78,27.3 v9.91,27.3
  other vias: 12.57,13.08 11.94,13.08 11.3,13.08 10.67,13.08 20.95,12.95 20.95,13.59 21.59,13.59 21.59,12.95
  pour Top (isolate 0.254, no thermals): 13.59,11.68 10.54,11.68 9.4,10.54 9.4,7.75 8.89,7.24 2.54,7.24 2.03,7.75 2.03,10.41 2.92,11.3 3.56,11.3 4.06,10.79 4.06,9.78 4.57,9.27 6.73,9.27 7.24,9.78 7.24,11.94 8.64,13.34 13.84,13.34 13.97,13.21 13.97,12.06
  pour Top (isolate 0.254, no thermals): 20.95,13.97 20.45,13.97 20.19,13.72 20.19,11.94 20.45,11.68 21.72,11.68 21.97,11.94 21.97,13.84 21.84,13.97
  pour Bottom (isolate 0.254, no thermals): 21.97,15.37 21.97,12.98 21.69,12.7 10.54,12.7 9.27,13.97 9.27,20.32 10.54,21.59 15.49,21.59 16.38,22.48 21.84,22.48 22.23,22.86 22.23,35.43 22.61,35.81 23.88,35.81 24.13,35.56 24.13,21.72 22.48,20.07 12.06,20.07 11.68,19.68 11.68,16.76 13.34,15.11 18.54,15.11 19.68,16.26 21.08,16.26
VIN
  pour Top (isolate 0.254, no thermals): 48.13,25.65 48.64,25.65 50.42,23.88 50.42,16.76 52.96,14.22 52.96,11.56 52.2,10.79 45.47,10.79 41.4,6.73 38.99,6.73 38.61,7.11 38.61,8.89 38.99,9.27 40.64,9.27 43.31,11.94 44.83,13.46 46.86,13.46 47.1,13.46 48.9,15.26 48.9,22.53 47.8,23.62 47.37,23.62 46.99,24 46.99,25.4 47.24,25.65
VIN_12V  (via drill 0.25 pad 0.51)
  Top 0.406: R10.2 v30.73,22.61
  Bottom 0.406: v30.73,22.61 30.73,22.23 32.89,20.07 32.89,16.51 v33.91,15.49
  pour Top (isolate 0.254, no thermals): 39.75,11.3 40.51,11.3 40.89,11.68 40.89,15.49 40.51,15.88 33.27,15.88 32.89,15.49 32.89,14.73 33.27,14.35 35.69,14.35 38.73,11.3

### Text on the board
tPlace: RST | 120Ω | I2C | GND | 5V | SDA | SCL | GND | 5V | RX | TX | UART | L(D13) | CANL | CANH | GND | D4 | VIN | RX | D5 | TX | D6 | SDA | A3 | SCL | D8 | 12 | A0 | D9 | 10 | A1 | A2 | 11 | GND | 5V | Iout=2A | RST | SCK | SO | PWR | GND | SI | 5V | VIN(7-28V) | RX | TX
bPlace: CANL | CANBed FD Dev Kit | CANH | V1.0 04/02/2020 | longan-labs.cc | GND | VIN | OBD-II | (default) | CAN OPEN